# Altium schematic sheet Main.SchDoc
size A
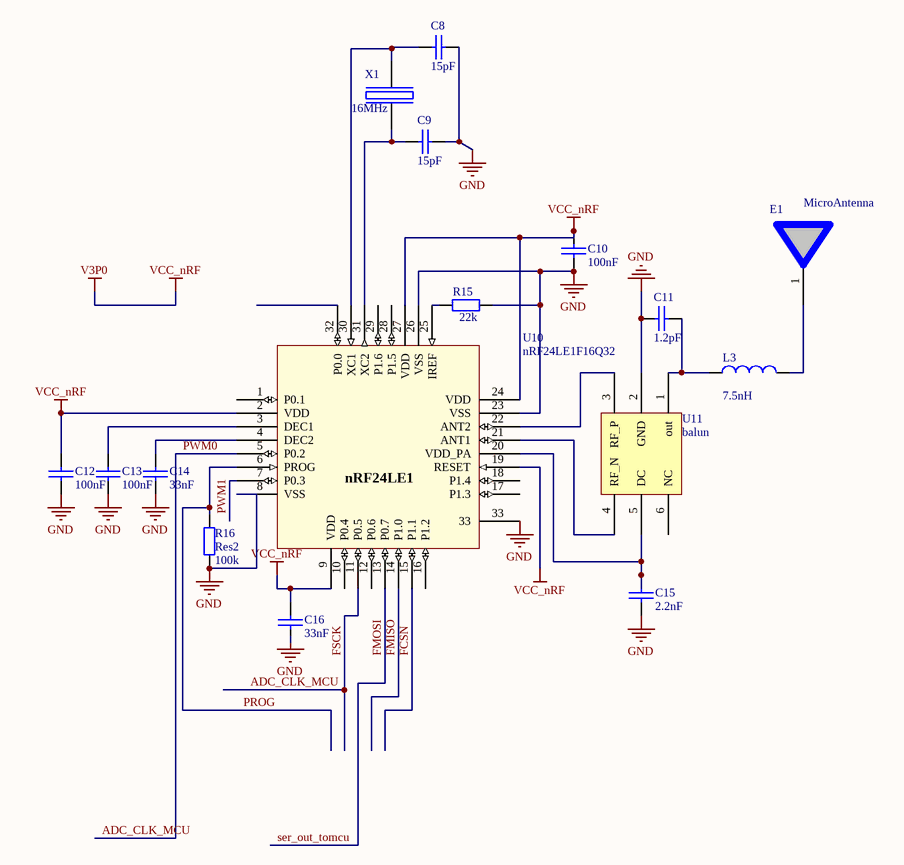
[diagram p0: Main.SchDoc]

## Parts
C8  value 15pF  [0402s]  (hidden comment: NP0 50V)
C9  value 15pF  [0402s]  (hidden comment: NP0 50V)
C10  value 100nF  [0402s]  (hidden comment: NP0 50V)
C11  value 1.2pF  [0402s]  (hidden comment: NP0 50V)
C12  value 100nF  [0402s]  (hidden comment: NP0 50V)
C13  value 100nF  [0402s]  (hidden comment: NP0 50V)
C14  value 33nF  [0402s]  (hidden comment: NP0 50V)
C15  value 2.2nF  [0402s]  (hidden comment: NP0 50V)
C16  value 33nF  [0402s]  (hidden comment: NP0 50V)
E1  MicroAntenna  [microantenna]
L3  value 7.5nH  [0402-A]  (hidden comment: Inductor)
R15  value 22k  [0402s]  (hidden comment: Res2)
R16  Res2  value 100k  [0402s]
U10  value nRF24LE1F16Q32  [Nordic_QFN50P500X500X90-33N]  (hidden comment: QFN32 5x5 package)
U11  balun  [balun]
X1  value 16MHz  [bt-xtal 2.5 x 2 mm]  (hidden comment: TSX-3225, 16MHz, Cl=9pF, +/-10ppm)

## Nets
GND: C8.1 C9.2 C10.2 C11.1 C12.2 C13.1 C14.2 C15.2 C16.1 R15.2 R16.1 U10.8(VSS) U10.23(VSS) U10.26(VSS) U10.33 U11.2(GND) X1.2(GND) X1.4(GND)
V3P0: C10.1 C12.1 C16.2 U10.2(VDD) U10.9(VDD) U10.19(RESET) U10.24(VDD) U10.27(VDD)  [also labelled VCC_nRF]
ADC_CLK_MCU: U10.5(P0.2) U10.11(P0.5)  [also labelled FSCK, PWM0]
FCSN: U10.15(P1.1)
FMISO: U10.14(P1.0)
FMOSI: U10.13(P0.7)  [also labelled ser_out_tomcu]
PROG: R16.2 U10.6(PROG)
PWM1: U10.7(P0.3)
NetC8_2: C8.2 U10.30(XC1) X1.3(out)
NetC9_1: C9.1 U10.31(XC2) X1.1(inp)
NetC11_2: C11.2 L3.1 U11.1(out)
NetC13_2: C13.2 U10.3(DEC1)
NetC14_1: C14.1 U10.4(DEC2)
NetC15_1: C15.1 U10.20(VDD_PA) U11.5(DC)
NetE1_1: E1.1 L3.2
NetR15_1: R15.1 U10.25(IREF)
NetU10_21: U10.21(ANT1) U11.4(RF_N)
NetU10_22: U10.22(ANT2) U11.3(RF_P)

Not connected (* = marked no-connect by the designer): E1 2; U10 1(P0.1) 10(P0.4) 12(P0.6) 16(P1.2) 17(P1.3) 18(P1.4) 28(P1.5) 29(P1.6) 32(P0.0); U11 6(NC)

## Notes on the sheet
- (in symbol nRF24LE1 - 5x5) nRF24LE1

## Library data of the parts
C8-C16 = Cap: Capacitor; Part Field 1: 0402
L3 = Inductor: Code_IEC: 1005; Published: 8-Jun-2000; LatestRevisionDate: 29-May-2009; LatestRevisionNote: IPC-7351 Footprint Added.; PackageReference: 0402-A; Publisher: Altium Limited; PackageDescription: Chip Inductor; Code_JEITA: 0402
R15 R16 = Res2: Resistor; Published: 8-Jun-2000; LatestRevisionDate: 17-Jul-2002; LatestRevisionNote: Re-released for DXP Platform.; PackageReference: AXIAL-0.4; Publisher: Altium Limited; PackageDescription: Axial Device, Thru-Hole; 2 Leads; 0.4 in Pin Spacing
U10 = nRF24LE1 - 5x5: 2.4GHz Tranceiver with embedded MCU and 10 bit ADC
X1 = BT-XTAL: Crystal